# EAGLE schematic ProgrammableModule2 (EAGLE 7.6.0)
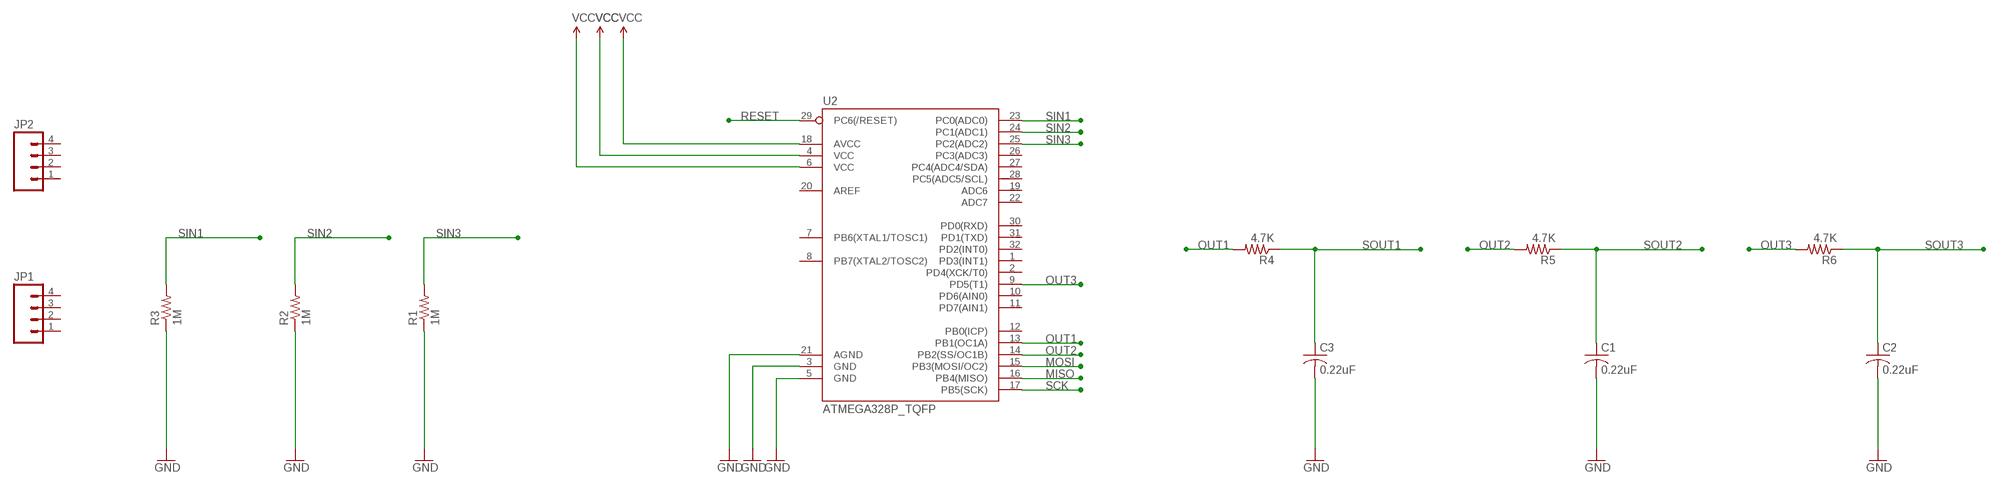
[diagram p0: schematic, sheet 1]

## Parts
C1  0.22uF  C-USC0603  [C0603]
C2  0.22uF  C-USC0603  [C0603]
C3  0.22uF  C-USC0603  [C0603]
JP1  M04PTH  [1X04]
JP2  M04PTH  [1X04]
R1  1M  R-US_R0603  [R0603]
R2  1M  R-US_R0603  [R0603]
R3  1M  R-US_R0603  [R0603]
R4  4.7K  R-US_R0603  [R0603]
R5  4.7K  R-US_R0603  [R0603]
R6  4.7K  R-US_R0603  [R0603]
U2  ATMEGA328P_TQFP  [TQFP32-08]

## Nets
GND: C1.2 C2.2 C3.2 R1.1 R2.1 R3.1 U2.3(GND) U2.5(GND) U2.21(AGND)
MISO: U2.16(PB4(MISO))
MOSI: U2.15(PB3(MOSI/OC2))
OUT1: R4.2 U2.13(PB1(OC1A))
OUT2: R5.2 U2.14(PB2(SS/OC1B))
OUT3: R6.2 U2.9(PD5(T1))
RESET: U2.29(PC6(/RESET))
SCK: U2.17(PB5(SCK))
SIN1: R3.2 U2.23(PC0(ADC0))
SIN2: R2.2 U2.24(PC1(ADC1))
SIN3: R1.2 U2.25(PC2(ADC2))
SOUT1: C3.1 R4.1
SOUT2: C1.1 R5.1
SOUT3: C2.1 R6.1
VCC: U2.4(VCC) U2.6(VCC) U2.18(AVCC)
Unconnected: JP1.1 JP1.2 JP1.3 JP1.4 JP2.1 JP2.2 JP2.3 JP2.4 U2.1(PD3(INT1)) U2.2(PD4(XCK/T0)) U2.7(PB6(XTAL1/TOSC1)) U2.8(PB7(XTAL2/TOSC2)) U2.10(PD6(AIN0)) U2.11(PD7(AIN1)) U2.12(PB0(ICP)) U2.19(ADC6) U2.20(AREF) U2.22(ADC7) U2.26(PC3(ADC3)) U2.27(PC4(ADC4/SDA)) U2.28(PC5(ADC5/SCL)) U2.30(PD0(RXD)) U2.31(PD1(TXD)) U2.32(PD2(INT0))

## Library data of the parts
C1-C3 = adafruit:C-US: CAPACITOR, American symbol
JP1 JP2 = SparkFun-Connectors:M04: Header 4 Standard 4-pin 0.1" header. Use with straight break away headers (SKU : PRT-00116), right angle break away headers (PRT-00553), swiss pins (PRT-00743), machine pins (PRT-00117), and female headers (PRT-00115). Molex polarized connector foot print use with SKU : PRT-08231 with associated crimp pins and housings. 1MM SMD Version SKU: PRT-10208
R1-R6 = adafruit:R-US_: RESISTOR, American symbol
U2 = SparkFun-DigitalIC:ATMEGA328P_TQFP; PROD_ID: IC-09069